# Altium schematic sheet BackPage.SchDoc: Back Page
size Letter; Engineer: Nathan Petersen; DocumentNumber: 22; SheetNumber: 22; SheetTotal: 23
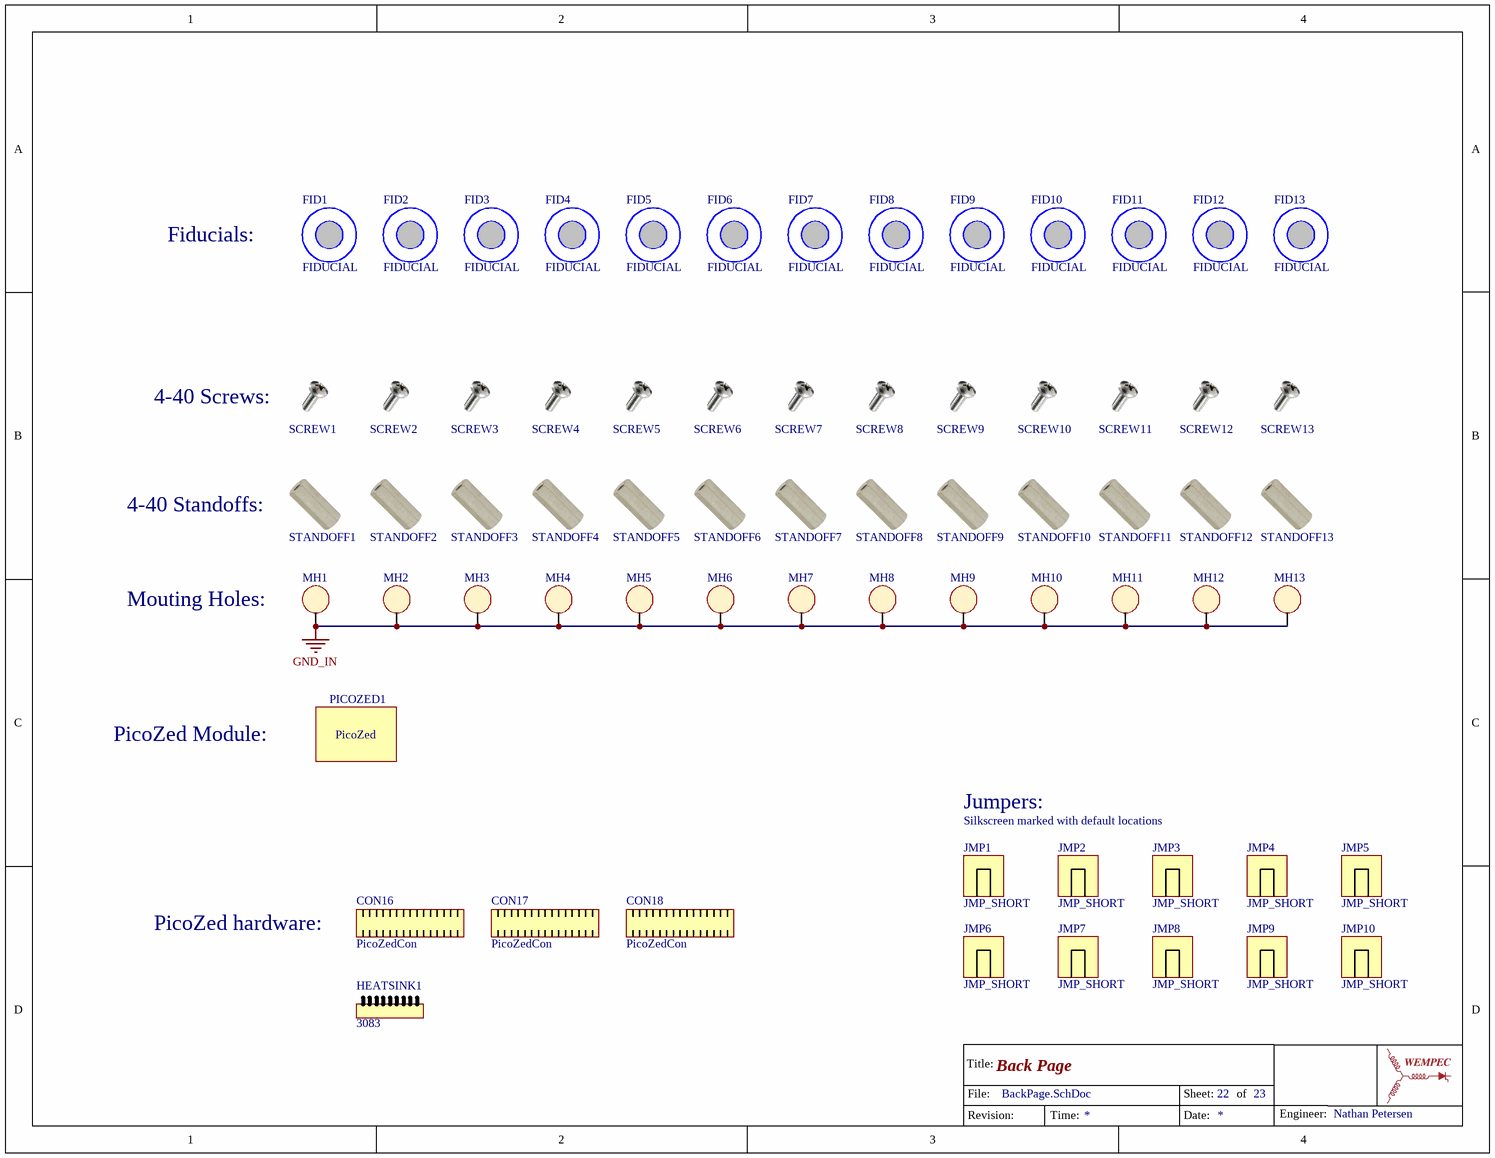
[diagram p0: BackPage.SchDoc]

## Parts
CON16  PicoZedCon  (mechanical)
CON17  PicoZedCon  (mechanical)
CON18  PicoZedCon  (mechanical)
FID1  FIDUCIAL  [FID_1mm]  (no BOM)
FID2  FIDUCIAL  [FID_1mm]  (no BOM)
FID3  FIDUCIAL  [FID_1mm]  (no BOM)
FID4  FIDUCIAL  [FID_1mm]  (no BOM)
FID5  FIDUCIAL  [FID_1mm]  (no BOM)
FID6  FIDUCIAL  [FID_1mm]  (no BOM)
FID7  FIDUCIAL  [FID_1mm]  (no BOM)
FID8  FIDUCIAL  [FID_1mm]  (no BOM)
FID9  FIDUCIAL  [FID_1mm]  (no BOM)
FID10  FIDUCIAL  [FID_1mm]  (no BOM)
FID11  FIDUCIAL  [FID_1mm]  (no BOM)
FID12  FIDUCIAL  [FID_1mm]  (no BOM)
FID13  FIDUCIAL  [FID_1mm]  (no BOM)
HEATSINK1  3083  (mechanical)
JMP1  JMP_SHORT  (mechanical)
JMP2  JMP_SHORT  (mechanical)
JMP3  JMP_SHORT  (mechanical)
JMP4  JMP_SHORT  (mechanical)
JMP5  JMP_SHORT  (mechanical)
JMP6  JMP_SHORT  (mechanical)
JMP7  JMP_SHORT  (mechanical)
JMP8  JMP_SHORT  (mechanical)
JMP9  JMP_SHORT  (mechanical)
JMP10  JMP_SHORT  (mechanical)
MH1  MOUNT_HOLE  [MOUNTING_HOLE]  (value not drawn)  (no BOM)
MH2  MOUNT_HOLE  [MOUNTING_HOLE]  (value not drawn)  (no BOM)
MH3  MOUNT_HOLE  [MOUNTING_HOLE]  (value not drawn)  (no BOM)
MH4  MOUNT_HOLE  [MOUNTING_HOLE]  (value not drawn)  (no BOM)
MH5  MOUNT_HOLE  [MOUNTING_HOLE]  (value not drawn)  (no BOM)
MH6  MOUNT_HOLE  [MOUNTING_HOLE]  (value not drawn)  (no BOM)
MH7  MOUNT_HOLE  [MOUNTING_HOLE]  (value not drawn)  (no BOM)
MH8  MOUNT_HOLE  [MOUNTING_HOLE]  (value not drawn)  (no BOM)
MH9  MOUNT_HOLE  [MOUNTING_HOLE]  (value not drawn)  (no BOM)
MH10  MOUNT_HOLE  [MOUNTING_HOLE]  (value not drawn)  (no BOM)
MH11  MOUNT_HOLE  [MOUNTING_HOLE]  (value not drawn)  (no BOM)
MH12  MOUNT_HOLE  [MOUNTING_HOLE]  (value not drawn)  (no BOM)
MH13  MOUNT_HOLE  [MOUNTING_HOLE]  (value not drawn)  (no BOM)
PICOZED1  7Z030-PicoZed  (value not drawn)  (mechanical)
SCREW1  Screw-4-40  (value not drawn)  (mechanical)
SCREW2  Screw-4-40  (value not drawn)  (mechanical)
SCREW3  Screw-4-40  (value not drawn)  (mechanical)
SCREW4  Screw-4-40  (value not drawn)  (mechanical)
SCREW5  Screw-4-40  (value not drawn)  (mechanical)
SCREW6  Screw-4-40  (value not drawn)  (mechanical)
SCREW7  Screw-4-40  (value not drawn)  (mechanical)
SCREW8  Screw-4-40  (value not drawn)  (mechanical)
SCREW9  Screw-4-40  (value not drawn)  (mechanical)
SCREW10  Screw-4-40  (value not drawn)  (mechanical)
SCREW11  Screw-4-40  (value not drawn)  (mechanical)
SCREW12  Screw-4-40  (value not drawn)  (mechanical)
SCREW13  Screw-4-40  (value not drawn)  (mechanical)
STANDOFF1  Standoff-4-40  (value not drawn)  (mechanical)
STANDOFF2  Standoff-4-40  (value not drawn)  (mechanical)
STANDOFF3  Standoff-4-40  (value not drawn)  (mechanical)
STANDOFF4  Standoff-4-40  (value not drawn)  (mechanical)
STANDOFF5  Standoff-4-40  (value not drawn)  (mechanical)
STANDOFF6  Standoff-4-40  (value not drawn)  (mechanical)
STANDOFF7  Standoff-4-40  (value not drawn)  (mechanical)
STANDOFF8  Standoff-4-40  (value not drawn)  (mechanical)
STANDOFF9  Standoff-4-40  (value not drawn)  (mechanical)
STANDOFF10  Standoff-4-40  (value not drawn)  (mechanical)
STANDOFF11  Standoff-4-40  (value not drawn)  (mechanical)
STANDOFF12  Standoff-4-40  (value not drawn)  (mechanical)
STANDOFF13  Standoff-4-40  (value not drawn)  (mechanical)

## Nets
GND_IN: MH1.1 MH2.1 MH3.1 MH4.1 MH5.1 MH6.1 MH7.1 MH8.1 MH9.1 MH10.1 MH11.1 MH12.1 MH13.1

## Notes on the sheet
- (near FID1) Fiducials:
- (near SCREW1) 4-40 Screws:
- (near STANDOFF1) 4-40 Standoffs:
- Mouting Holes:
- PicoZed Module:
- Jumpers:
- Silkscreen marked with default locations
- PicoZed hardware:
- Title:
- File:
- Sheet:
- of
- Revision:
- Time:
- Date:
- Engineer:
- (in symbol 7Z030-PicoZed) PicoZed

## Library data of the parts
CON16-CON18 = PicoZedCon: CONN HEADER 100POS .8MM DUAL SMD; Supplier 1: Digi-Key; Supplier Part Number 1: 609-1693-1-ND
HEATSINK1 = PicoZedHeatSink: ALUM HEAT SINK FOR RASPBERRY PI; Supplier 1: Digi-Key; Supplier Part Number 1: 1528-1697-ND
JMP1-JMP10 = JUMPER_SHORT: CONN JUMPER SHORTING .100" GOLD; Supplier 1: Digi-Key; Supplier Part Number 1: S9337-ND
MH1-MH13 = MOUNT_HOLE: MOUNTING HOLE
PICOZED1 = 7Z030-PicoZed: PicoZed 7030 SOM Evaluation Board with ARM Cortex-A9 1 x 10/100/1000 eMMC/QSPI Flash; Supplier 1: Newark; Supplier Part Number 1: AES-Z7PZ-7Z030-SOM-I-G/REV-E
SCREW1-SCREW13 = Screw-4-40: Supplier 1: Digi-Key; Supplier Part Number 1: 36-9900-ND
STANDOFF1-STANDOFF13 = Standoff-4-40: Supplier 1: Digi-Key; Supplier Part Number 1: 36-1656-ND